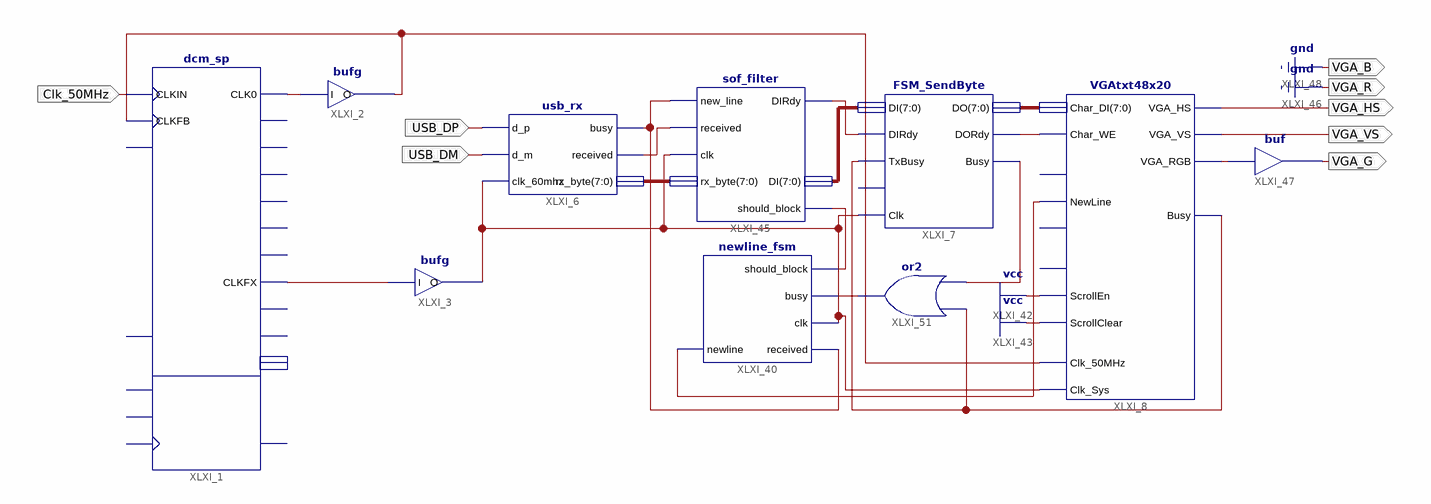
[diagram p0: schematic sheet 1]
// Xilinx ISE schematic top_lvl.sch (spartan3e) as structural Verilog: 10 symbols, 8 ports
module top_lvl (
  input  Clk_50MHz,
  input  USB_DM,
  input  USB_DP,
  output VGA_HS,
  output VGA_VS,
  output VGA_R,
  output VGA_B,
  output VGA_G
);

  wire Clk_50, XLXN_2, XLXN_3, XLXN_7, XLXN_77, XLXN_99, XLXN_100, XLXN_110, XLXN_111, XLXN_112, XLXN_115,
       XLXN_141, XLXN_149, XLXN_184;
  wire [7:0] XLXN_75, XLXN_76, XLXN_109;

  FSM_SendByte XLXI_7 (
    .Clk(XLXN_184), .DIRdy(XLXN_110), .TxBusy(XLXN_141), .DI(XLXN_109), .DORdy(XLXN_77), .Busy(XLXN_100),
    .DO(XLXN_76));  // open: Reset
  usb_rx XLXI_6 (
    .d_p(USB_DP), .d_m(USB_DM), .clk_60mhz(XLXN_184), .busy(XLXN_111), .received(XLXN_112), .rx_byte(XLXN_75));
  bufg XLXI_3 (.I(XLXN_3), .O(XLXN_184));
  bufg XLXI_2 (.I(XLXN_2), .O(Clk_50));
  dcm_sp #(.CLKFX_MULTIPLY(6), .CLKFX_DIVIDE(5)) XLXI_1 (
    .CLKFB(Clk_50), .CLKIN(Clk_50MHz), .CLK0(XLXN_2), .CLKFX(XLXN_3));  // open: DSSEN, PSCLK, PSEN, PSINCDEC, RST, CLK180, CLK270, CLK2X, CLK2X180, CLK90, CLKDV, CLKFX180, LOCKED, PSDONE, STATUS
  VGAtxt48x20 XLXI_8 (
    .Char_DI(XLXN_76), .NewLine(XLXN_149), .Clk_Sys(XLXN_184), .Clk_50MHz(Clk_50), .ScrollEn(1'b1),
    .ScrollClear(1'b1), .Busy(XLXN_141), .VGA_HS(VGA_HS), .VGA_VS(VGA_VS), .VGA_RGB(XLXN_7), .Char_WE(XLXN_77));  // open: Home, Goto00, CursorOn
  newline_fsm XLXI_40 (
    .received(XLXN_111), .clk(XLXN_184), .busy(XLXN_99), .newline(XLXN_149), .should_block(XLXN_115));
  sof_filter XLXI_45 (
    .new_line(XLXN_111), .received(XLXN_112), .clk(XLXN_184), .rx_byte(XLXN_75), .DIRdy(XLXN_110),
    .DI(XLXN_109), .should_block(XLXN_115));
  or XLXI_51 (XLXN_99, XLXN_100, XLXN_141);
  buf XLXI_47 (VGA_G, XLXN_7);

  assign VGA_B = 1'b0;
  assign VGA_R = 1'b0;
endmodule
